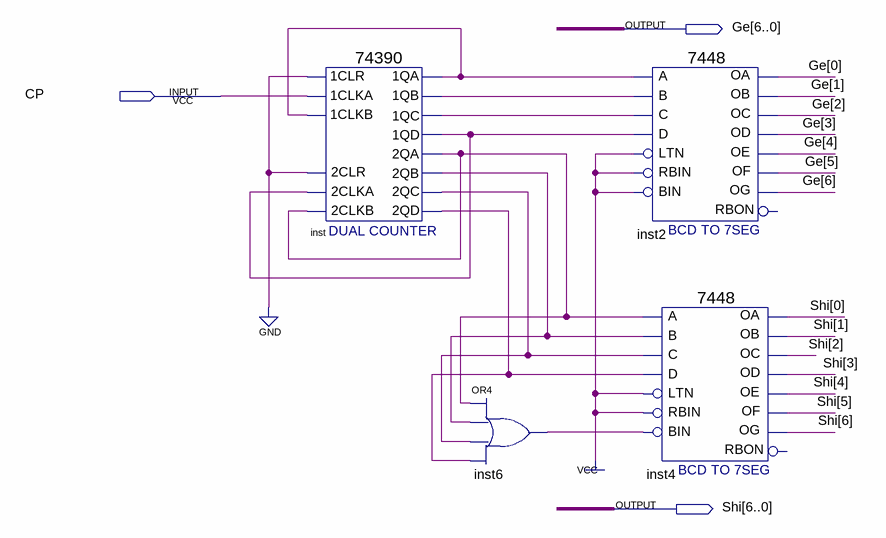
[diagram p0: schematic sheet]
// Quartus schematic lab2.bdf as structural Verilog: 4 symbols, 3 pins
module lab2 (
  input  CP,
  output [6:0] Ge,
  output [6:0] Shi
);

  wire inst6_out, inst_1qa, inst_1qb, inst_1qc, inst_1qd, inst_2qa, inst_2qb, inst_2qc, inst_2qd;

  \74390  inst (
    .\2CLKA (inst_1qd), .\2CLR (1'b0), .\2CLKB (inst_2qa), .\1CLR (1'b0), .\1CLKA (CP), .\1CLKB (inst_1qa),
    .\1QA (inst_1qa), .\1QB (inst_1qb), .\1QC (inst_1qc), .\1QD (inst_1qd), .\2QA (inst_2qa),
    .\2QB (inst_2qb), .\2QC (inst_2qc), .\2QD (inst_2qd));
  or inst6 (inst6_out, inst_2qa, inst_2qb, inst_2qc, inst_2qd);
  \7448  inst2 (
    .A(inst_1qa), .C(inst_1qc), .D(inst_1qd), .B(inst_1qb), .RBIN(1'b1), .BIN(1'b1), .LTN(1'b1), .OC(Ge[2]),
    .OE(Ge[4]), .OD(Ge[3]), .OF(Ge[5]), .OG(Ge[6]), .OB(Ge[1]), .OA(Ge[0]));  // open: RBON
  \7448  inst4 (
    .A(inst_2qa), .C(inst_2qc), .D(inst_2qd), .B(inst_2qb), .RBIN(1'b1), .BIN(inst6_out), .LTN(1'b1),
    .OC(Shi[2]), .OE(Shi[4]), .OD(Shi[3]), .OF(Shi[5]), .OG(Shi[6]), .OB(Shi[1]), .OA(Shi[0]));  // open: RBON
endmodule
